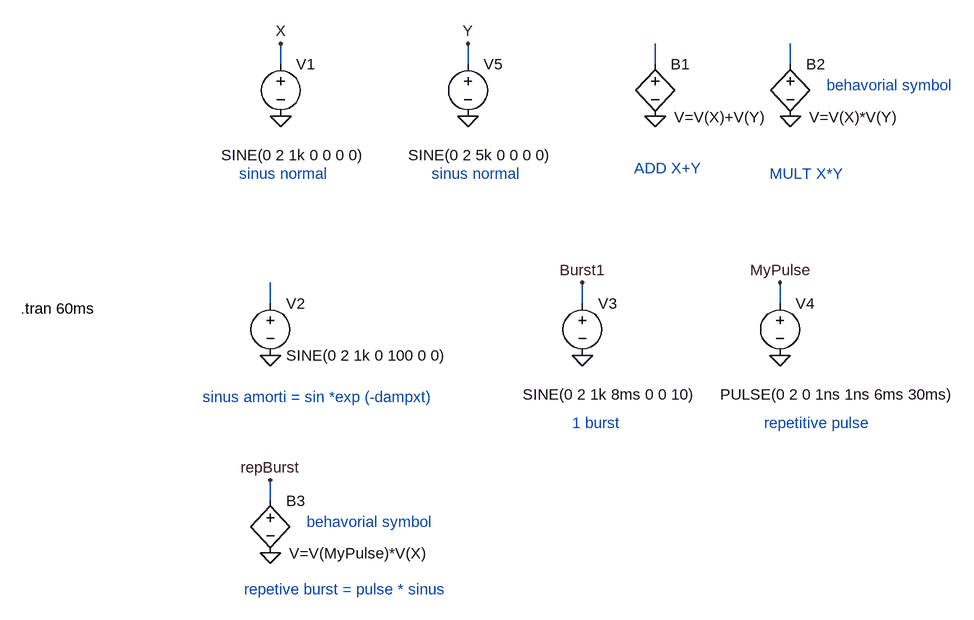
[diagram p0: schematic signaux.asc]
signaux.asc, the LTspice schematic file:
Version 4
SHEET 1 1028 680
WIRE -640 -608 -640 -640
WIRE -352 -608 -352 -640
WIRE -64 -608 -64 -640
WIRE 144 -608 144 -640
WIRE -656 -240 -656 -272
WIRE -176 -240 -176 -272
WIRE 128 -240 128 -272
WIRE -656 64 -656 32
FLAG -640 -528 0
FLAG -656 -160 0
FLAG -176 -160 0
FLAG -64 -528 0
FLAG -352 -528 0
FLAG -640 -640 X
FLAG -352 -640 Y
FLAG 144 -528 0
FLAG 128 -160 0
FLAG -656 144 0
FLAG 128 -272 MyPulse
FLAG -656 32 repBurst
FLAG -176 -272 Burst1
SYMBOL voltage -640 -624 R0
WINDOW 3 -92 156 Left 2
WINDOW 123 0 0 Left 2
WINDOW 39 0 0 Left 2
SYMATTR InstName V1
SYMATTR Value SINE(0 2 1k 0 0 0 0)
SYMBOL voltage -656 -256 R0
WINDOW 123 0 0 Left 2
WINDOW 39 0 0 Left 2
SYMATTR InstName V2
SYMATTR Value SINE(0 2 1k 0 100 0 0)
SYMBOL voltage -176 -256 R0
WINDOW 3 -92 156 Left 2
WINDOW 123 0 0 Left 2
WINDOW 39 0 0 Left 2
SYMATTR InstName V3
SYMATTR Value SINE(0 2 1k 8ms 0 0 10)
SYMBOL voltage -352 -624 R0
WINDOW 3 -92 156 Left 2
WINDOW 123 0 0 Left 2
WINDOW 39 0 0 Left 2
SYMATTR InstName V5
SYMATTR Value SINE(0 2 5k 0 0 0 0)
SYMBOL bv -64 -624 R0
WINDOW 3 29 97 Left 2
SYMATTR InstName B1
SYMATTR Value V=V(X)+V(Y)
SYMBOL bv 144 -624 R0
WINDOW 3 29 97 Left 2
SYMATTR InstName B2
SYMATTR Value V=V(X)*V(Y)
SYMBOL voltage 128 -256 R0
WINDOW 3 -92 156 Left 2
WINDOW 123 0 0 Left 2
WINDOW 39 0 0 Left 2
SYMATTR InstName V4
SYMATTR Value PULSE(0 2 0 1ns 1ns 6ms 30ms)
SYMBOL bv -656 48 R0
WINDOW 3 29 97 Left 2
SYMATTR InstName B3
SYMATTR Value V=V(MyPulse)*V(X)
TEXT -1040 -232 Left 2 !.tran 60ms
TEXT -704 -440 Left 2 ;sinus normal
TEXT -760 -96 Left 2 ;sinus amorti = sin *exp (-dampxt)
TEXT -192 -56 Left 2 ;1 burst
TEXT -408 -440 Left 2 ;sinus normal
TEXT -96 -448 Left 2 ;ADD X+Y
TEXT 112 -440 Left 2 ;MULT X*Y
TEXT 200 -576 Left 2 ;behavorial symbol
TEXT 104 -56 Left 2 ;repetitive pulse
TEXT -696 200 Left 2 ;repetive burst = pulse * sinus
TEXT -600 96 Left 2 ;behavorial symbol

The netlist it stands for:
* signaux.asc
V1 X 0 SINE(0 2 1k 0 0 0 0)
V2 N003 0 SINE(0 2 1k 0 100 0 0)
V3 Burst1 0 SINE(0 2 1k 8ms 0 0 10)
V5 Y 0 SINE(0 2 5k 0 0 0 0)
B1 N001 0 V=V(X)+V(Y)
B2 N002 0 V=V(X)*V(Y)
V4 MyPulse 0 PULSE(0 2 0 1ns 1ns 6ms 30ms)
B3 repBurst 0 V=V(MyPulse)*V(X)
.tran 60ms
* sinus normal
* sinus amorti = sin *exp (-dampxt)
* 1 burst
* sinus normal
* ADD X+Y
* MULT X*Y
* behavorial symbol
* repetitive pulse
* repetive burst = pulse * sinus
* behavorial symbol
.backanno
.end

* Results of the author's LTspice run, read from the files saved beside the schematic
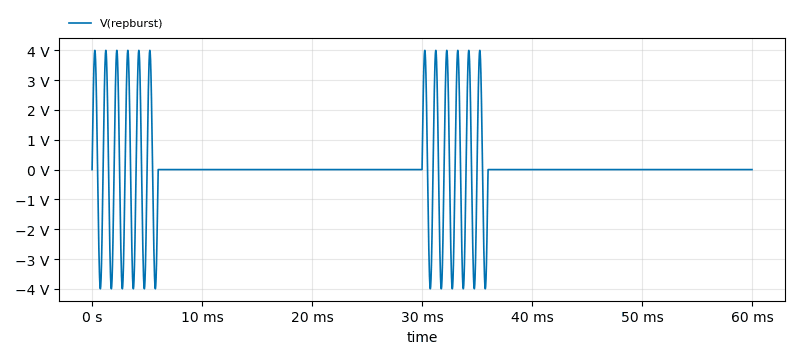
[diagram p1: Transient Analysis of signaux.asc, plotted from the saved traces]
* Transient Analysis, 1 run:
*   V(repburst): min -4 V, max 4 V, average 1.12 µV, rms 1.265 V, last 0 V